# Altium project MainBoard.PrjPCB (part 2 of 2)

## Sheet Mainboard_MCU_Breakout.SchDoc
size C
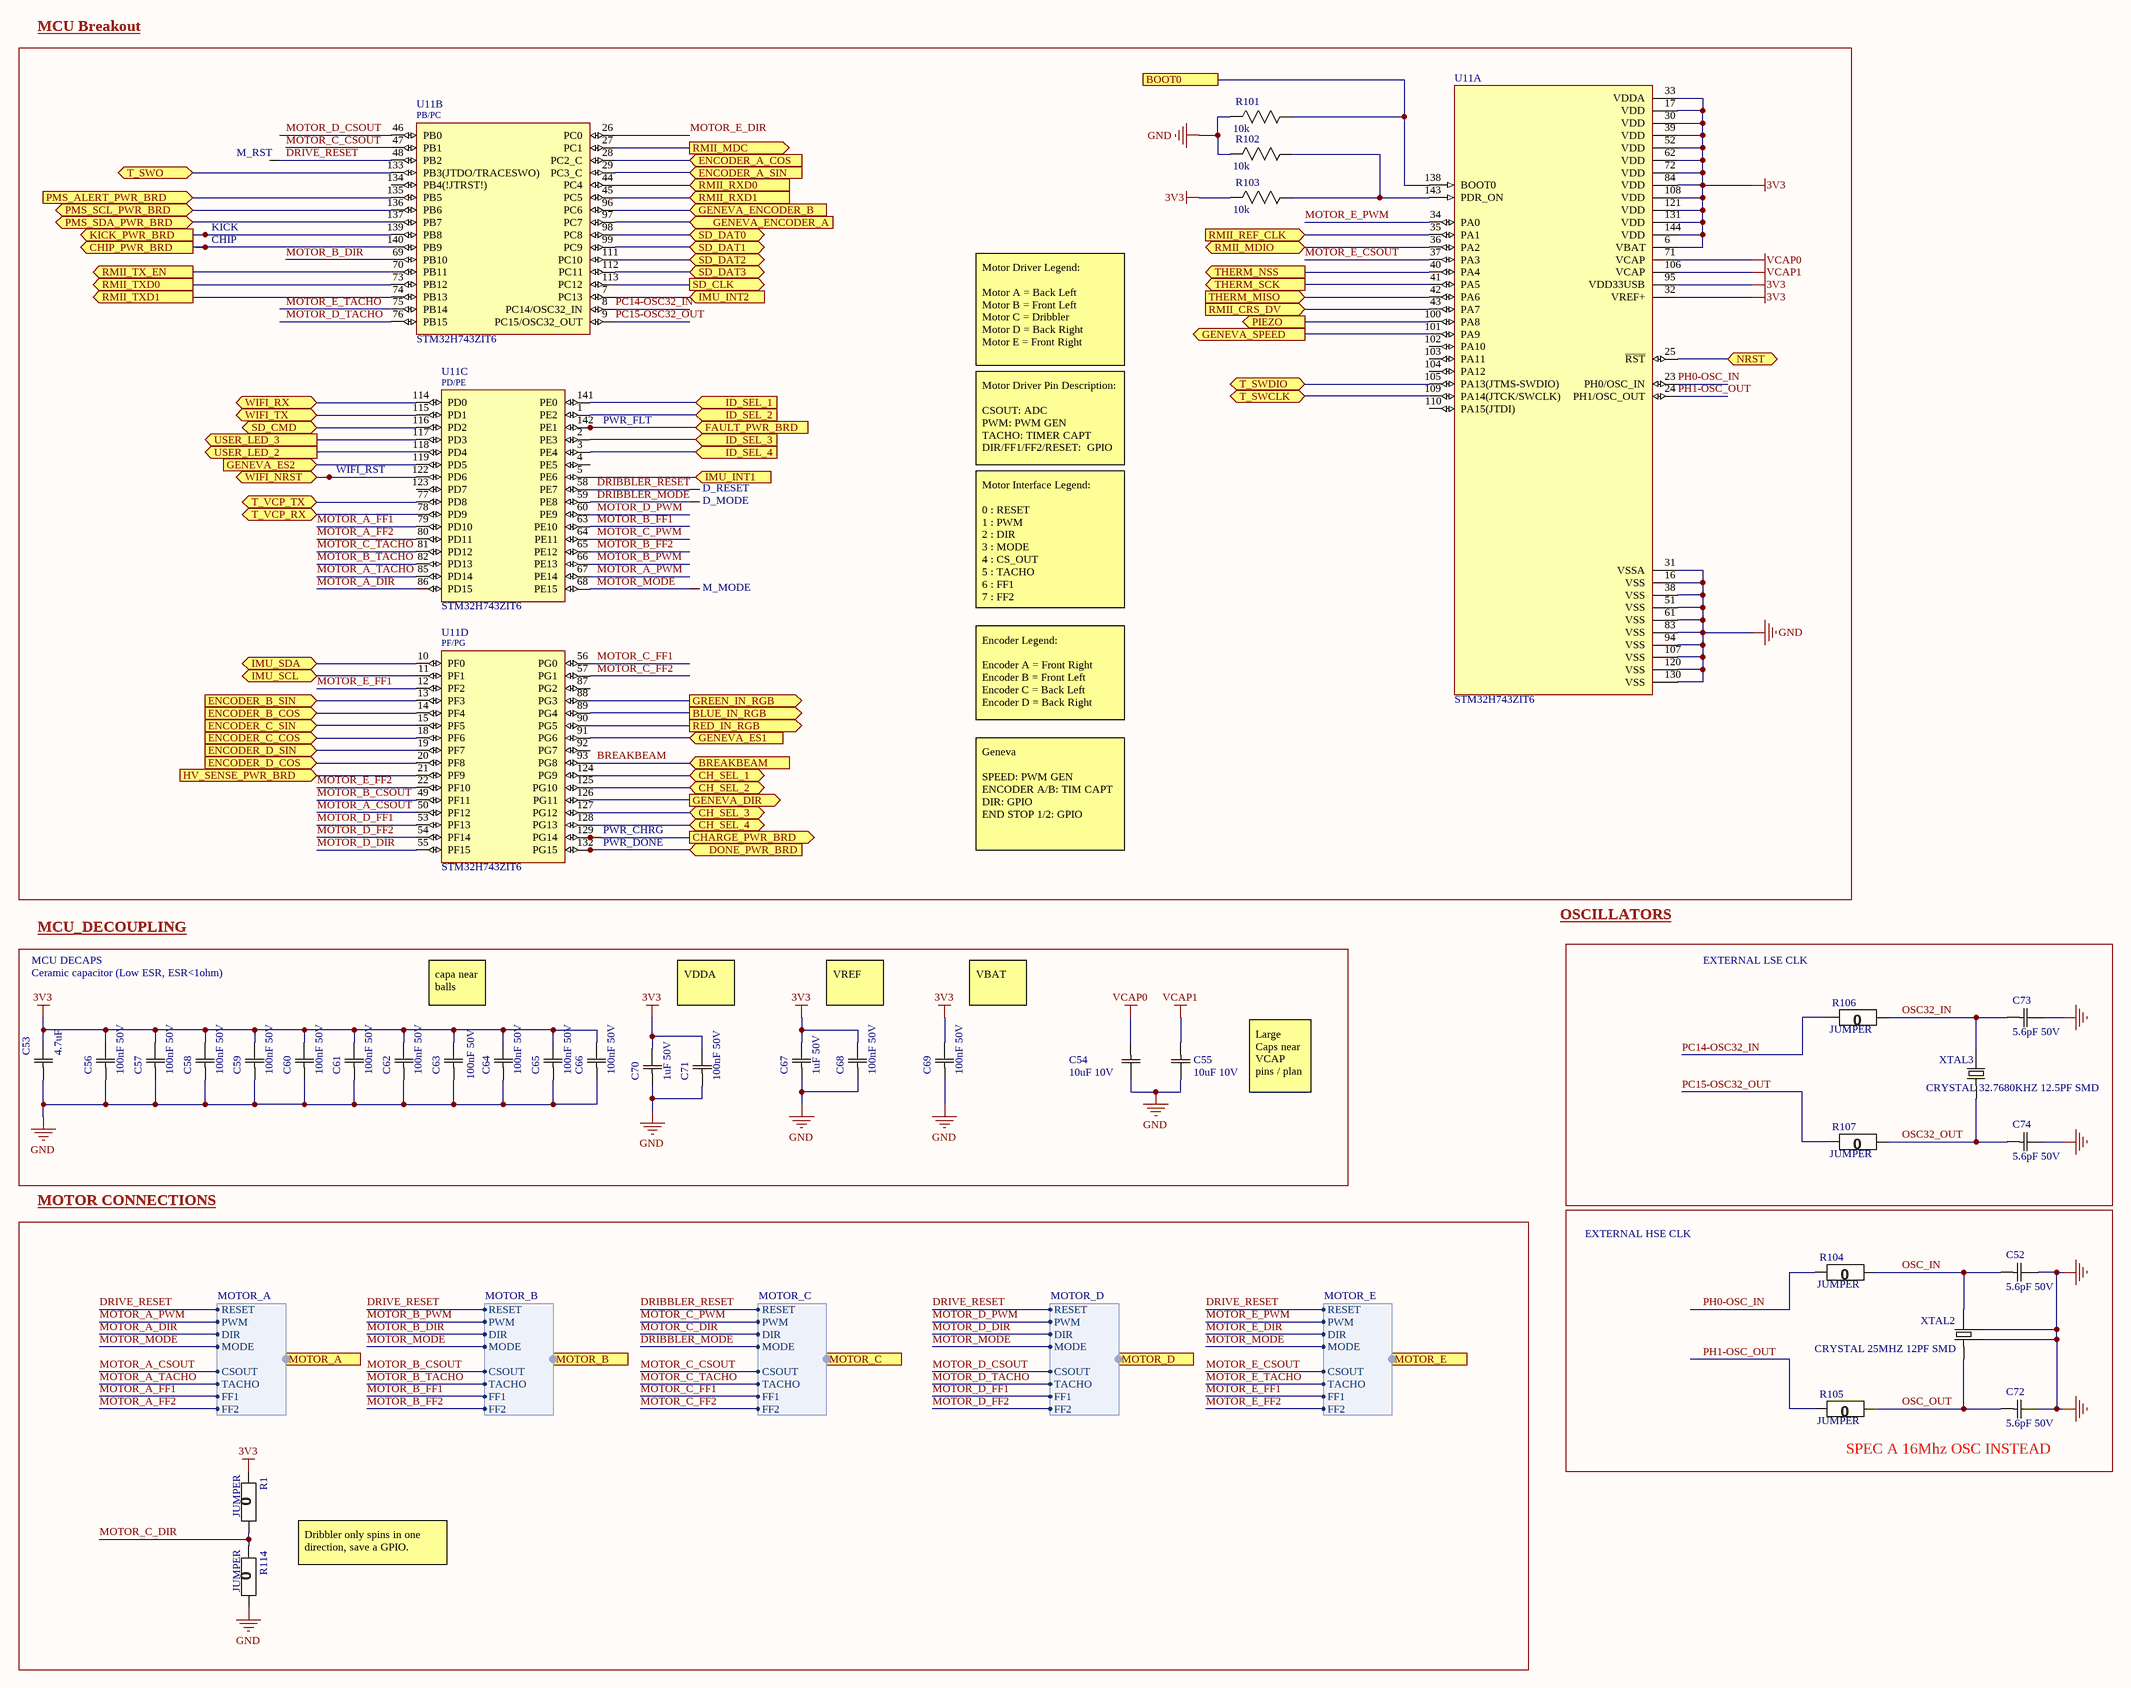
[diagram p8: Mainboard_MCU_Breakout.SchDoc]

### Parts
C52  5.6pF 50V  [0603]
C53  4.7uF  [0603]
C54  10uF 10V  [0603]
C55  10uF 10V  [0603]
C56  100nF 50V  [0603]
C57  100nF 50V  [0603]
C58  100nF 50V  [0603]
C59  100nF 50V  [0603]
C60  100nF 50V  [0603]
C61  100nF 50V  [0603]
C62  100nF 50V  [0603]
C63  100nF 50V  [0603]
C64  100nF 50V  [0603]
C65  100nF 50V  [0603]
C66  100nF 50V  [0603]
C67  1uF 50V  [0603]
C68  100nF 50V  [0603]
C69  100nF 50V  [0603]
C70  1uF 50V  [0603]
C71  100nF 50V  [0603]
C72  5.6pF 50V  [0603]
C73  5.6pF 50V  [0603]
C74  5.6pF 50V  [0603]
CHIP  Test Point (Via)  [TP]  (value not drawn)
D_MODE  Test Point (Via)  [TP]  (value not drawn)
D_RESET  Test Point (Via)  [TP]  (value not drawn)
KICK  Test Point (Via)  [TP]  (value not drawn)
M_MODE  Test Point (Via)  [TP]  (value not drawn)
M_RST  Test Point (Via)  [TP]  (value not drawn)
PWR_CHRG  Test Point (Via)  [TP]  (value not drawn)
PWR_DONE  Test Point (Via)  [TP]  (value not drawn)
PWR_FLT  Test Point (Via)  [TP]  (value not drawn)
R1  JUMPER  [0603]
R101  10k  [0603]
R102  10k  [0603]
R103  10k  [0603]
R104  JUMPER  [0603]
R105  JUMPER  [0603]
R106  JUMPER  [0603]
R107  JUMPER  [0603]
R114  JUMPER  [0603]
U11  STM32H743ZIT6  [QFP50P2200X2200X160-144N]  (parts A,B,C,D of 4)
WIFI_RST  Test Point (Via)  [TP]  (value not drawn)
XTAL2  CRYSTAL 25MHZ 12PF SMD  [3225-4SMD]
XTAL3  CRYSTAL 32.7680KHZ 12.5PF SMD  [3215 SMD2]

### Blocks framed on the sheet
MCU Breakout: CHIP D_MODE D_RESET KICK M_MODE M_RST PWR_CHRG PWR_DONE PWR_FLT R101-R103 U11 WIFI_RST
MCU_DECOUPLING: C53-C71
EXTERNAL LSE CLK: C73 C74 R106 R107 XTAL3
MOTOR CONNECTIONS: R1 R114
SPEC A 16Mhz OSC INSTEAD: C52 C72 R104 R105 XTAL2

### Ports
BLUE_IN_RGB (out), BOOT0, BREAKBEAM (in), CH_SEL_1 (bidir), CH_SEL_2 (bidir), CH_SEL_3 (bidir), CH_SEL_4 (bidir), CHARGE_PWR_BRD (out), CHIP_PWR_BRD (out), DONE_PWR_BRD (in), ENCODER_A_COS (in), ENCODER_A_SIN (in), ENCODER_B_COS (in), ENCODER_B_SIN (in), ENCODER_C_COS (in), ENCODER_C_SIN (in), ENCODER_D_COS (in), ENCODER_D_SIN (in), FAULT_PWR_BRD (in), GENEVA_DIR (out), GENEVA_ENCODER_A (in), GENEVA_ENCODER_B (in), GENEVA_ES1 (in), GENEVA_ES2 (in), GENEVA_SPEED (out), GREEN_IN_RGB (out), HV_SENSE_PWR_BRD (in), ID_SEL_1 (in), ID_SEL_2 (in), ID_SEL_3 (in), ID_SEL_4 (in), IMU_INT1 (in), IMU_INT2 (in), IMU_SCL (bidir), IMU_SDA (bidir), KICK_PWR_BRD (out), MOTOR_A (harness MOTOR_A), MOTOR_B (harness MOTOR_B), MOTOR_C (harness MOTOR_C), MOTOR_D (harness MOTOR_D), MOTOR_E (harness MOTOR_E), NRST (bidir), PIEZO (out), PMS_ALERT_PWR_BRD (in), PMS_SCL_PWR_BRD (bidir), PMS_SDA_PWR_BRD (bidir), RED_IN_RGB (out), RMII_CRS_DV (in), RMII_MDC (out), RMII_MDIO (bidir), RMII_REF_CLK (in), RMII_RXD0 (in), RMII_RXD1 (in), RMII_TX_EN (out), RMII_TXD0 (out), RMII_TXD1 (out), SD_CLK (out), SD_CMD (bidir), SD_DAT0 (bidir), SD_DAT1 (bidir), SD_DAT2 (bidir), SD_DAT3 (bidir), T_SWCLK (bidir), T_SWDIO (bidir), T_SWO (bidir), T_VCP_RX (bidir), T_VCP_TX (bidir), THERM_MISO (in), THERM_NSS (out), THERM_SCK (out), USER_LED_2 (out), USER_LED_3 (out), WIFI_NRST (bidir), WIFI_RX (bidir), WIFI_TX (bidir)

### Harnesses
MOTOR_E: DIR, MODE, TACHO, FF1, FF2, PWM, RESET, CSOUT
MOTOR_A: DIR, MODE, TACHO, FF1, FF2, PWM, RESET, CSOUT
MOTOR_B: DIR, MODE, TACHO, FF1, FF2, PWM, RESET, CSOUT
MOTOR_C: DIR, MODE, TACHO, FF1, FF2, PWM, RESET, CSOUT
MOTOR_D: DIR, MODE, TACHO, FF1, FF2, PWM, RESET, CSOUT

### Nets
3V3: C53.2(C2) C56.2(C2) C57.2(C2) C58.2(C2) C59.2(C2) C60.2(C2) C61.2(C2) C62.2(C2) C63.2(C2) C64.2(C2) C65.2(C2) C66.2(C2) C67.2(C2) C68.2(C2) C69.2(C2) C70.2(C2) C71.2(C2) R1.2(R2) R103.2(R2) U11.6(VBAT) U11.17(VDD) U11.30(VDD) U11.32(VREF+) U11.33(VDDA) U11.39(VDD) U11.52(VDD) U11.62(VDD) U11.72(VDD) U11.84(VDD) U11.95(VDD33USB) U11.108(VDD) U11.121(VDD) U11.131(VDD) U11.144(VDD)
GND: C52.2(C2) C53.1(C1) C54.2(C2) C55.2(C2) C56.1(C1) C57.1(C1) C58.1(C1) C59.1(C1) C60.1(C1) C61.1(C1) C62.1(C1) C63.1(C1) C64.1(C1) C65.1(C1) C66.1(C1) C67.1(C1) C68.1(C1) C69.1(C1) C70.1(C1) C71.1(C1) C72.2(C2) C73.2(C2) C74.2(C2) R101.2(R2) R102.2(R2) R114.1(R1) U11.16(VSS) U11.31(VSSA) U11.38(VSS) U11.51(VSS) U11.61(VSS) U11.83(VSS) U11.94(VSS) U11.107(VSS) U11.120(VSS) U11.130(VSS) XTAL2.2 XTAL2.4
VCAP0: C54.1(C1) U11.71(VCAP)
VCAP1: C55.1(C1) U11.106(VCAP)
BREAKBEAM: U11.93(PG8) ; port BREAKBEAM
CHARGE_PWR_BRD: PWR_CHRG.1 U11.129(PG14) ; port CHARGE_PWR_BRD
CHIP_PWR_BRD: CHIP.1 U11.140(PB9) ; port CHIP_PWR_BRD
DONE_PWR_BRD: PWR_DONE.1 U11.132(PG15) ; port DONE_PWR_BRD
DRIBBLER_MODE: D_MODE.1 U11.59(PE8) ; port MOTOR_C.MODE
DRIBBLER_RESET: D_RESET.1 U11.58(PE7) ; port MOTOR_C.RESET
DRIVE_RESET: M_RST.1 U11.48(PB2) ; port MOTOR_E.RESET, port MOTOR_A.RESET, port MOTOR_B.RESET, port MOTOR_D.RESET
EA_COS: U11.28(PC2_C) ; port ENCODER_A_COS
EA_SIN: U11.29(PC3_C) ; port ENCODER_A_SIN
EB_COS: U11.14(PF4) ; port ENCODER_B_COS
EB_SIN: U11.13(PF3) ; port ENCODER_B_SIN
EC_COS: U11.18(PF6) ; port ENCODER_C_COS
EC_SIN: U11.15(PF5) ; port ENCODER_C_SIN
ED_COS: U11.20(PF8) ; port ENCODER_D_COS
ED_SIN: U11.19(PF7) ; port ENCODER_D_SIN
FAULT_PWR_BRD: PWR_FLT.1 U11.142(PE1) ; port FAULT_PWR_BRD
GEN_DIR: U11.126(PG11) ; port GENEVA_DIR
GEN_ES1: U11.91(PG6) ; port GENEVA_ES1
GEN_ES2: U11.119(PD5) ; port GENEVA_ES2
GEN_SPD: U11.101(PA9) ; port GENEVA_SPEED
GENENC_A: U11.97(PC7) ; port GENEVA_ENCODER_A
GENENC_B: U11.96(PC6) ; port GENEVA_ENCODER_B
KICK_PWR_BRD: KICK.1 U11.139(PB8) ; port KICK_PWR_BRD
MOTOR_A_CSOUT: U11.50(PF12) ; port MOTOR_A.CSOUT  [project net CSOUT]
MOTOR_A_DIR: U11.86(PD15) ; port MOTOR_A.DIR  [project net DIR]
MOTOR_A_FF1: U11.79(PD10) ; port MOTOR_A.FF1  [project net FF1]
MOTOR_A_FF2: U11.80(PD11) ; port MOTOR_A.FF2  [project net FF2]
MOTOR_A_PWM: U11.67(PE14) ; port MOTOR_A.PWM
MOTOR_A_TACHO: U11.85(PD14) ; port MOTOR_A.TACHO
MOTOR_B_CSOUT: U11.49(PF11) ; port MOTOR_B.CSOUT  [project net CSOUT]
MOTOR_B_DIR: U11.69(PB10) ; port MOTOR_B.DIR  [project net DIR]
MOTOR_B_FF1: U11.63(PE10) ; port MOTOR_B.FF1  [project net FF1]
MOTOR_B_FF2: U11.65(PE12) ; port MOTOR_B.FF2  [project net FF2]
MOTOR_B_PWM: U11.66(PE13) ; port MOTOR_B.PWM
MOTOR_B_TACHO: U11.82(PD13) ; port MOTOR_B.TACHO
MOTOR_C_CSOUT: U11.47(PB1) ; port MOTOR_C.CSOUT  [project net CSOUT]
MOTOR_C_DIR: R1.1(R1) R114.2(R2) ; port MOTOR_C.DIR  [project net DIR]
MOTOR_C_FF1: U11.56(PG0) ; port MOTOR_C.FF1  [project net FF1]
MOTOR_C_FF2: U11.57(PG1) ; port MOTOR_C.FF2  [project net FF2]
MOTOR_C_PWM: U11.64(PE11) ; port MOTOR_C.PWM
MOTOR_C_TACHO: U11.81(PD12) ; port MOTOR_C.TACHO
MOTOR_D_CSOUT: U11.46(PB0) ; port MOTOR_D.CSOUT  [project net CSOUT]
MOTOR_D_DIR: U11.55(PF15) ; port MOTOR_D.DIR  [project net DIR]
MOTOR_D_FF1: U11.53(PF13) ; port MOTOR_D.FF1  [project net FF1]
MOTOR_D_FF2: U11.54(PF14) ; port MOTOR_D.FF2  [project net FF2]
MOTOR_D_PWM: U11.60(PE9) ; port MOTOR_D.PWM
MOTOR_D_TACHO: U11.76(PB15) ; port MOTOR_D.TACHO
MOTOR_E_CSOUT: U11.37(PA3) ; port MOTOR_E.CSOUT  [project net CSOUT]
MOTOR_E_DIR: U11.26(PC0) ; port MOTOR_E.DIR  [project net DIR]
MOTOR_E_FF1: U11.12(PF2) ; port MOTOR_E.FF1  [project net FF1]
MOTOR_E_FF2: U11.22(PF10) ; port MOTOR_E.FF2  [project net FF2]
MOTOR_E_PWM: U11.34(PA0) ; port MOTOR_E.PWM
MOTOR_E_TACHO: U11.75(PB14) ; port MOTOR_E.TACHO
MOTOR_MODE: M_MODE.1 U11.68(PE15) ; port MOTOR_E.MODE, port MOTOR_A.MODE, port MOTOR_B.MODE, port MOTOR_D.MODE  [project net MODE]
NRST: U11.25(~{RST}) ; port NRST
OSC32_IN: C73.1(C1) R106.1(R1) XTAL3.2
OSC32_OUT: C74.1(C1) R107.1(R1) XTAL3.1
OSC_IN: C52.1(C1) R104.1(R1) XTAL2.3
OSC_OUT: C72.1(C1) R105.1(R1) XTAL2.1
PC14-OSC32_IN: R106.2(R2) U11.8(PC14/OSC32_IN)
PC15-OSC32_OUT: R107.2(R2) U11.9(PC15/OSC32_OUT)
PH0-OSC_IN: R104.2(R2) U11.23(PH0/OSC_IN)
PH1-OSC_OUT: R105.2(R2) U11.24(PH1/OSC_OUT)
PMS_ALERT_PWR_BRD: U11.135(PB5) ; port PMS_ALERT_PWR_BRD
PMS_SCL_PWR_BRD: U11.136(PB6) ; port PMS_SCL_PWR_BRD
PMS_SDA_PWR_BRD: U11.137(PB7) ; port PMS_SDA_PWR_BRD
RMII_CRS_DV: U11.43(PA7) ; port RMII_CRS_DV
RMII_MDC: U11.27(PC1) ; port RMII_MDC
RMII_MDIO: U11.36(PA2) ; port RMII_MDIO
RMII_REF_CLK: U11.35(PA1) ; port RMII_REF_CLK
RMII_RXD0: U11.44(PC4) ; port RMII_RXD0
RMII_RXD1: U11.45(PC5) ; port RMII_RXD1
RMII_TX_EN: U11.70(PB11) ; port RMII_TX_EN
RMII_TXD0: U11.73(PB12) ; port RMII_TXD0
RMII_TXD1: U11.74(PB13) ; port RMII_TXD1
NetD3_1: U11.100(PA8) ; port PIEZO
NetHV_FB1_1: U11.21(PF9) ; port HV_SENSE_PWR_BRD
NetJ9_2: U11.114(PD0) ; port WIFI_RX
NetJ9_3: U11.115(PD1) ; port WIFI_TX
NetJ9_4: U11.122(PD6) WIFI_RST.1 ; port WIFI_NRST
NetJ12_1: U11.111(PC10) ; port SD_DAT2
NetJ12_2: U11.112(PC11) ; port SD_DAT3
NetJ12_3: U11.116(PD2) ; port SD_CMD
NetJ12_5: U11.113(PC12) ; port SD_CLK
NetJ12_7: U11.98(PC8) ; port SD_DAT0
NetJ12_8: U11.99(PC9) ; port SD_DAT1
NetPboot1_1: R101.1(R1) U11.138(BOOT0) ; port BOOT0
NetR91_2: U11.118(PD4) ; port USER_LED_2
NetR94_1: U11.90(PG5) ; port RED_IN_RGB
NetR95_1: U11.89(PG4) ; port BLUE_IN_RGB
NetR97_1: U11.88(PG3) ; port GREEN_IN_RGB
NetR99_2: U11.117(PD3) ; port USER_LED_3
NetR102_1: R102.1(R1) R103.1(R1) U11.143(PDR_ON)
NetR109_1: U11.41(PA5) ; port THERM_SCK
NetR110_1: U11.42(PA6) ; port THERM_MISO
NetR111_1: U11.40(PA4) ; port THERM_NSS
NetR115_2: U11.124(PG9) ; port CH_SEL_1
NetR116_2: U11.125(PG10) ; port CH_SEL_2
NetR117_2: U11.127(PG12) ; port CH_SEL_3
NetR118_2: U11.128(PG13) ; port CH_SEL_4
NetR119_2: U11.141(PE0) ; port ID_SEL_1
NetR120_2: U11.1(PE2) ; port ID_SEL_2
NetR121_2: U11.2(PE3) ; port ID_SEL_3
NetR122_2: U11.3(PE4) ; port ID_SEL_4
NetU9_4: U11.5(PE6) ; port IMU_INT1
NetU9_9: U11.7(PC13) ; port IMU_INT2
NetU9_13: U11.11(PF1) ; port IMU_SCL
NetU9_14: U11.10(PF0) ; port IMU_SDA
NetU10_4: U11.105(PA13(JTMS-SWDIO)) ; port T_SWDIO
NetU10_6: U11.133(PB3(JTDO/TRACESWO)) ; port T_SWO
NetU10_12: U11.77(PD8) ; port T_VCP_TX
NetU10_13: U11.109(PA14(JTCK/SWCLK)) ; port T_SWCLK
NetU10_15: U11.78(PD9) ; port T_VCP_RX

Not connected (* = marked no-connect by the designer): U11 4(PE5) 87(PG2) 92(PG7) 102(PA10) 103(PA11) 104(PA12) 110(PA15(JTDI)) 123(PD7) 134(PB4(!JTRST!))

### Notes on the sheet
- Motor Driver Legend:
  Motor A = Back Left
  Motor B = Front Left
  Motor C = Dribbler
  Motor D = Back Right
  Motor E = Front Right
- Motor Driver Pin Description:
  CSOUT: ADC
  PWM: PWM GEN
  TACHO: TIMER CAPT
  DIR/FF1/FF2/RESET:  GPIO
- Motor Interface Legend:
  0 : RESET
  1 : PWM
  2 : DIR
  3 : MODE
  4 : CS_OUT
  5 : TACHO
  6 : FF1
  7 : FF2
- Encoder Legend:
  Encoder A = Front Right
  Encoder B = Front Left
  Encoder C = Back Left
  Encoder D = Back Right
- Geneva
  SPEED: PWM GEN
  ENCODER A/B: TIM CAPT
  DIR: GPIO
  END STOP 1/2: GPIO
- MCU DECAPS
- Ceramic capacitor (Low ESR, ESR<1ohm)
- OSCILLATORS
- capa near balls
- VDDA
- VREF
- VBAT
- Large Caps near VCAP pins / plan
- EXTERNAL HSE CLK
- Dribbler only spins in one direction, save a GPIO.
- (in symbol STM32H743ZIT6, part B) PB/PC
- (in symbol STM32H743ZIT6, part C) PD/PE
- (in symbol STM32H743ZIT6, part D) PF/PG

### Library data of the parts
C52 C72-C74 = CAP 5.6pF 50V: CAP CER 5.6PF 50V C0G/NP0 0805; Tolerance: 5%; Package: 0805; Value: 5.6pF; Rating: 50V; Temperature Coefficient: C0G/NP0; Operating Temperature: -55°C ~ 125°C
C53 = CAP 4.7uF 35V: CAP CER 4.7UF 35V X7R 0603/0805; Tolerance: 10%; Package: 0603/0805; Value: 4.7uF; Rating: 35V; Temperature Coefficient: X7R; Operating Temperature: -55°C ~ 125°C
C54 C55 = CAP 10uF 10V: CAP CER 10UF 10V X5R 0805; Tolerance: 10%; Package: 0805; Value: 10uF; Rating: 10V
C56-C66 C68 C69 C71 = CAP 100nF 50V: CAP CER 0.1UF 50V X7R 0805; Tolerance: 10%; Package: 0805; Value: 100nF; Rating: 50V
C67 C70 = CAP 1uF 50V: CAP CER 1UF 50V X7R 0805; Tolerance: 10%; Package: 0805; Value: 1uF; Rating: 50V; Temperature Coefficient: X7R; Operating Temperature: -55°C ~ 125°C
R1 R104-R107 R114 = RES 0 JUMPER: as R77 on sheet Mainboard_RMII_Interface; Package: 0805
R101-R103 = RES 10k 1/8W - 1%: as R62 on sheet Mainboard_RMII_Interface; Package: 0805; Value: 10k; Tolerance: 1%
U11 = STM32H743ZIT6: ARM® Cortex®-M7 STM32H7 Microcontroller IC 32-Bit 480MHz 2MB (2M x 8) FLASH 144-LQFP (20x20); MF: STMicroelectronics; Package: LQFP-144 STMicroelectronics; MP: STM32H743ZIT6; ComponentLink1Description: SnapEDA; ComponentLink1URL: https://www.snapeda.com/parts/STM32H743ZIT6/STMicroelectronics/view-part/1041111/?ref=snap; ComponentLink2Description: DigiKey; ComponentLink2URL: https://www.digikey.ca/en/products/detail/stmicroelectronics/STM32H743ZIT6/7809238; ComponentLink3Description: Datasheet; ComponentLink3URL: https://www.st.com/resource/en/datasheet/stm32h743bi.pdf; Digikey: 497-17721-ND
XTAL2 = XTAL 25MHZ 12PF SMD4: 25MHz ±10ppm Crystal 12pF 40 Ohms 2-SMD, No Lead; MP: X322525MOB4SI; MF: Yangxing Tech; ESR: 70 Ohms; Package: 2-SMD, No Lead; Frequency: 25MHz; Load Capacitance: 12pF; Supplier 1: Digi-Key
XTAL3 = XTAL 32.7680KHZ 12.5PF SMD 3215: 32.768kHz ±20ppm Crystal 12.5pF 70 kOhms 3215SMD, No Lead; MP: Q13FC1350000400; MF: Seiko Epson; Package: 2-SMD, No Lead; Frequency: 32.768kHz; Load Capacitance: 12.5pF; ESR: 70 kOhms; ComponentLink1Description: Digikey; ComponentLink1URL: https://www.digikey.ca/en/products/detail/ndk-america-inc/NX3215SA-32-768K-STD-MUA-8/2261469; ComponentLink2Description: Datasheet; ComponentLink2URL: https://media.digikey.com/datasheets/production/702868/1/NX3215SA-32-768K-STD-MUA-8.html; Supplier 1: RSComponents; Supplier Part Number 1: 1712309

## Sheet Mainboard_MCU_Func.SchDoc
size A4
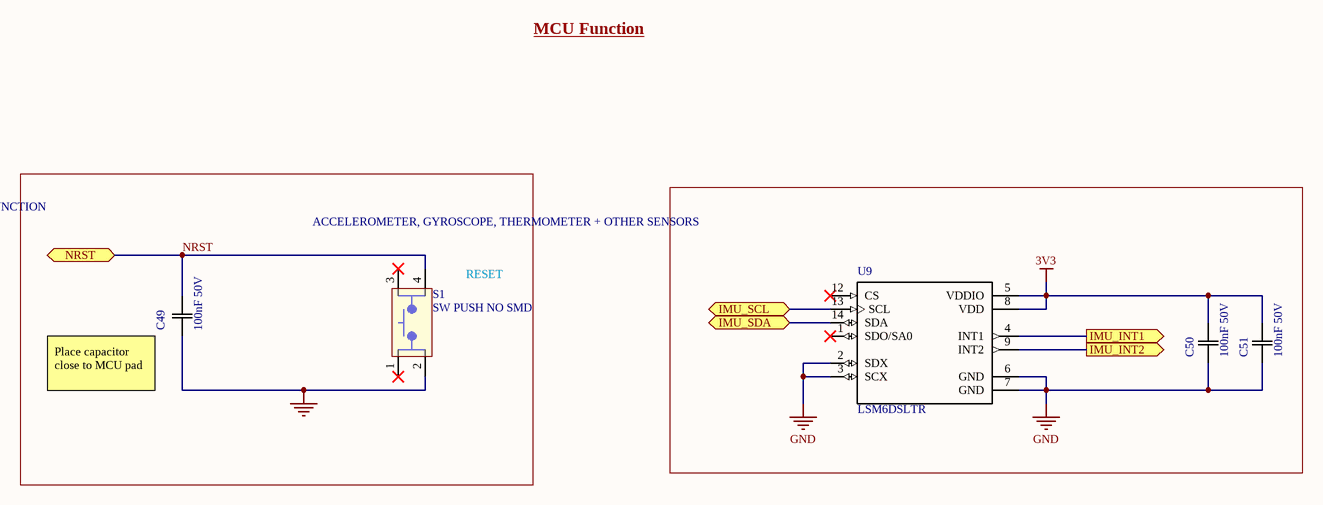
[diagram p9: Mainboard_MCU_Func.SchDoc]

### Parts
C49  100nF 50V  [0603]
C50  100nF 50V  [0603]
C51  100nF 50V  [0603]
S1  SW PUSH NO SMD  [TL3305]
U9  LSM6DSLTR  [LGA-14]

### Blocks framed on the sheet
ACCELEROMETER, GYROSCOPE, THERMOMETER + OTHER SENSORS: C50 C51 U9

### Ports
IMU_INT1 (out), IMU_INT2 (out), IMU_SCL (bidir), IMU_SDA (bidir), NRST (bidir)

### Nets
3V3: C50.2(C2) C51.2(C2) U9.5(VDDIO) U9.8(VDD)
GND: C49.1(C1) C50.1(C1) C51.1(C1) S1.2 U9.2(SDX) U9.3(SCX) U9.6(GND) U9.7(GND)
NRST: C49.2(C2) S1.4 ; port NRST
NetU9_4: U9.4(INT1) ; port IMU_INT1
NetU9_9: U9.9(INT2) ; port IMU_INT2
NetU9_13: U9.13(SCL) ; port IMU_SCL
NetU9_14: U9.14(SDA) ; port IMU_SDA

Not connected (* = marked no-connect by the designer): S1 1* 3*; U9 1(SDO/SA0)* 12(CS)*

### Notes on the sheet
- MCU Function
- RESET FUNCTION
- (near S1) RESET
- (near C49) Place capacitor close to MCU pad

### Library data of the parts
C49-C51 = CAP 100nF 50V: as C56 on sheet Mainboard_MCU_Breakout; Package: 0805; Value: 100nF; Rating: 50V
S1 = SW PUSH NO SMD: Tactile Switch SPST-NO Top Actuated Surface Mount 12V 50mA; MF: E-Switch; MP: TL3305BF260QG; Switch Function: Off-Mom; Actuator Height: 5mm; Digikey: EG5354DKR-ND; ComponentLink1Description: Digikey; ComponentLink1URL: https://www.digikey.ca/en/products/detail/e-switch/TL3305BF260QG/5816185; ComponentLink2Description: Datasheet; ComponentLink2URL: https://sten-eswitch-13110800-production.s3.amazonaws.com/system/asset/product_line/data_sheet/213/TL3305.pdf; Circuit: SPST-NO; Mounting Type: SMD
U9 = IMU LSM6DSLTR: IMU ACCEL/GYRO I2C/SPI 14LGA; MF: STMicroelectronics; SnapEDA_Link: https://www.snapeda.com/parts/LSM6DSLTR/STMicroelectronics/view-part/550517/?ref=snap; MP: LSM6DSLTR; Package: LGA-14 STMicroelectronics; Digikey: https://www.digikey.ca/product-detail/en/stmicroelectronics/LSM6DSLTR/497-16705-1-ND/6192805; Supplier 1: Digi-Key; Supplier Part Number 1: 497-16705-1-ND

## Sheet Mainboard_ThermistorAmp.SchDoc
size A
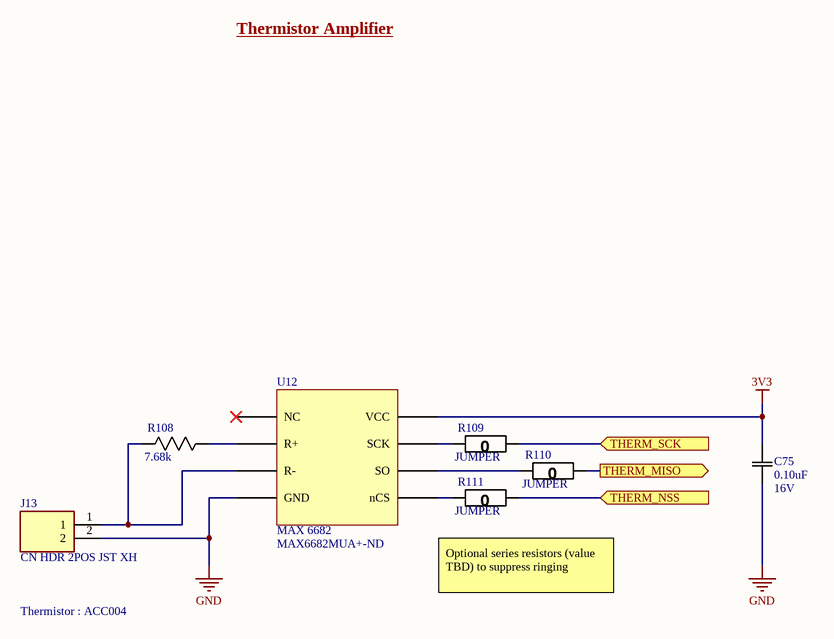
[diagram p10: Mainboard_ThermistorAmp.SchDoc]

### Parts
C75  Rating: 16V  [0603]  (hidden comment: 0.10uF)
J13  CN HDR 2POS JST XH  [JST_B2B-XH-A(LF)(SN)]
R108  7.68k  [0805]
R109  JUMPER  [0603]
R110  JUMPER  [0603]
R111  JUMPER  [0603]
U12  MAX 6682  Supplier Part Number 1: MAX6682MUA+-ND  [8-MSOP]

### Ports
THERM_MISO (out), THERM_NSS (in), THERM_SCK (in)

### Nets
3V3: C75.1(C1) U12.8(VCC)
GND: C75.2(C2) J13.2 U12.4(GND)
NetJ13_1: J13.1 R108.2(R2) U12.3(R-)
NetR108_1: R108.1(R1) U12.2(R+)
NetR109_1: R109.1(R1) ; port THERM_SCK
NetR109_2: R109.2(R2) U12.7(SCK)
NetR110_1: R110.1(R1) ; port THERM_MISO
NetR110_2: R110.2(R2) U12.6(SO)
NetR111_1: R111.1(R1) ; port THERM_NSS
NetR111_2: R111.2(R2) U12.5(nCS)

Not connected (* = marked no-connect by the designer): U12 1(NC)*

### Notes on the sheet
- Thermistor Amplifier
- Optional series resistors (value TBD) to suppress ringing
- Thermistor : ACC004

### Library data of the parts
C75 = CAP 0.10uF 16V: CAP CER 0.10UF 16V X5R 0603/0805; Tolerance: 10%; Package: 0603/0805; Temperature Coefficient: X5R; Operating Temperature: -55°C ~ 85°C; Value: 0.10uF
J13 = CN HDR 2POS JST XH: as HV_FB1 on sheet Mainboard_Power_Interface; Price: None; Package: None; Value: *; Availability: Unavailable; SnapEDA_Link: https://www.snapeda.com/parts/B2B-XH-A%28LF%29%28SN%29/JST%20Sales%20America%20Inc./view-part/492310/?ref=snap
R108 = RES 7.68k 0.15W: RES SMD 7.68K OHM 0.1% 0.15W 0805; Power (Watts): 0.125W; Tolerance: 5%; Package: 0805; Value: 7.68k
R109-R111 = RES 0 JUMPER: as R77 on sheet Mainboard_RMII_Interface; Package: 0805
U12 = MAX 6682: MAX 6685 Thermistor - SPI converter, 8bit; Supplier 1: Digi-Key

## Sheet Mainboard_User_Interface.SchDoc
size A4
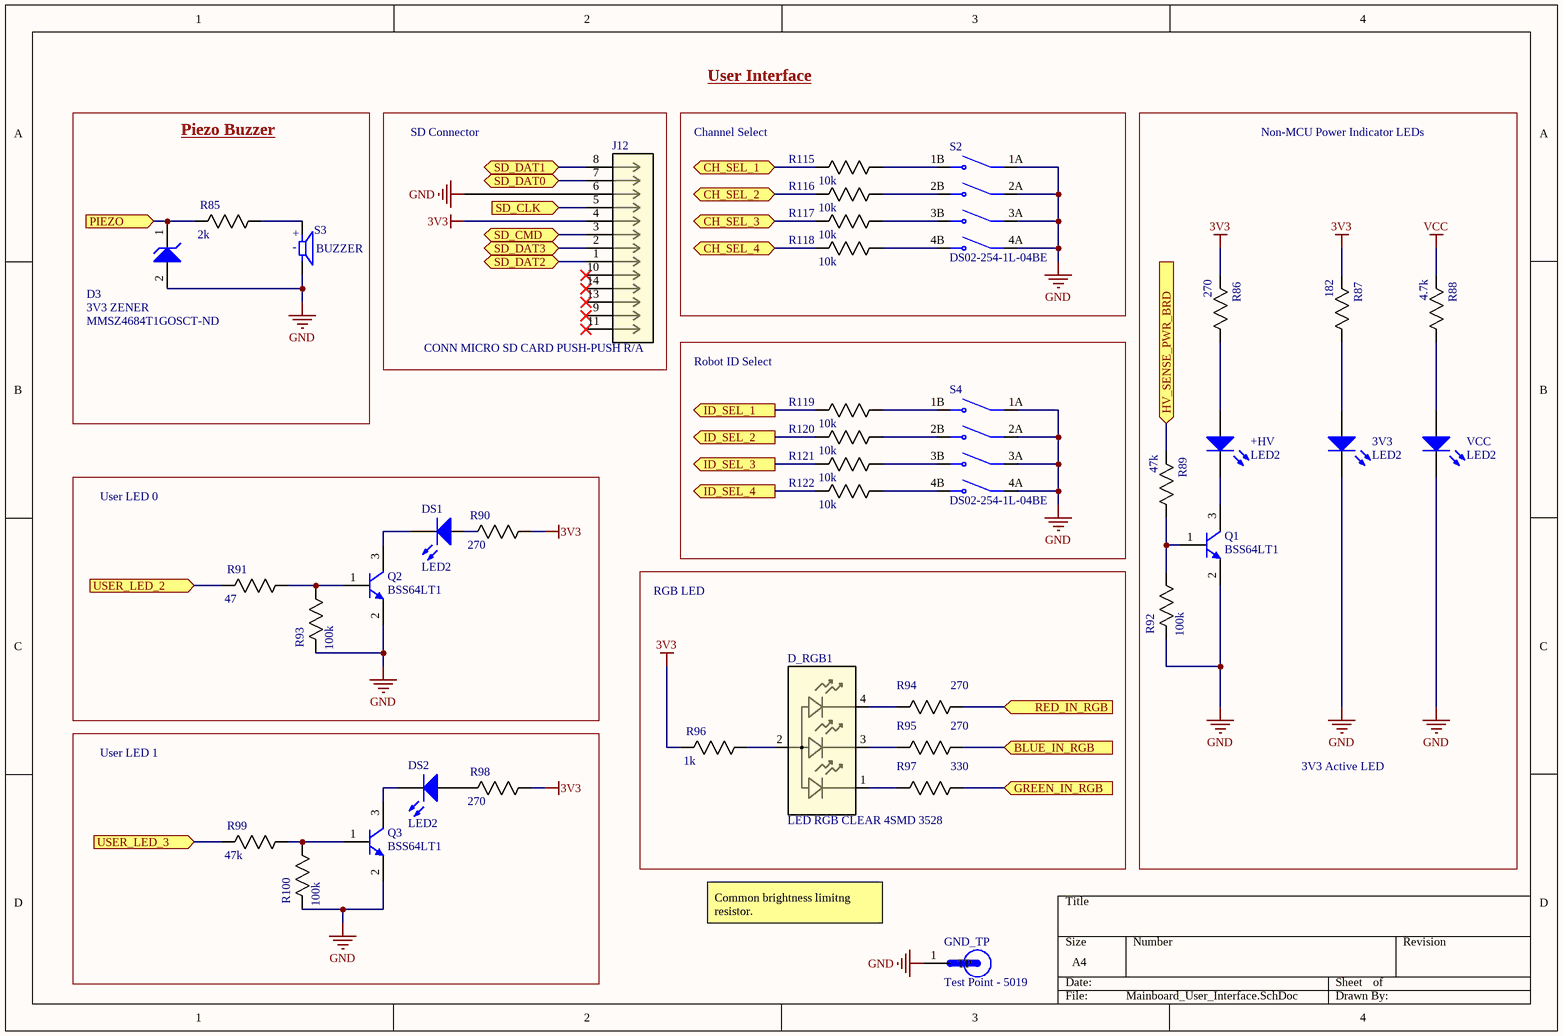
[diagram p11: Mainboard_User_Interface.SchDoc]

### Parts
3V3  LED2  [3.2X1.6X1.1]
+HV  LED2  [3.2X1.6X1.1]
D3  3V3 ZENER  Supplier Part Number 1: MMSZ4684T1GOSCT-ND  [ONSC-SOD-123-2-425-04_V]
D_RGB1  LED RGB CLEAR 4SMD 3528  [LED 4pin 3.5 x 2.8]
DS1  LED2  [3.2X1.6X1.1]
DS2  LED2  [3.2X1.6X1.1]
GND_TP  Test Point - 5019  [TP380X203]
J12  CONN MICRO SD CARD PUSH-PUSH R/A  [SD Connector 5027740891]
Q1  BSS64LT1  [ONSC-SOT-23-3-318-08_V]
Q2  BSS64LT1  [ONSC-SOT-23-3-318-08_V]
Q3  BSS64LT1  [ONSC-SOT-23-3-318-08_V]
R85  2k  [0603]
R86  270  [0603]
R87  182  [0603]
R88  4.7k  [0603]
R89  47k  [0603]
R90  270  [0603]
R91  47  [0603]
R92  100k  [0603]
R93  100k  [0603]
R94  270  [0603]
R95  270  [0603]
R96  1k  [0603]
R97  330  [0603]
R98  270  [0603]
R99  47k  [0603]
R100  100k  [0603]
R115  10k  [0603]
R116  10k  [0603]
R117  10k  [0603]
R118  10k  [0603]
R119  10k  [0603]
R120  10k  [0603]
R121  10k  [0603]
R122  10k  [0603]
S2  DS02-254-1L-04BE  [SW_DS02-254-1L-04BE]
S3  BUZZER  [BUZZER PKM13EPYH4000-A0]
S4  DS02-254-1L-04BE  [SW_DS02-254-1L-04BE]
VCC  LED2  [3.2X1.6X1.1]

### Blocks framed on the sheet
Piezo Buzzer: D3 R85 S3
SD Connector: J12
Channel Select: R115-R118 S2
Robot ID Select: R119-R122 S4
User LED 0: DS1 Q2 R90 R91 R93
RGB LED: D_RGB1 R94-R97
User LED 1: DS2 Q3 R98-R100

### Ports
BLUE_IN_RGB (in), CH_SEL_1 (bidir), CH_SEL_2 (bidir), CH_SEL_3 (bidir), CH_SEL_4 (bidir), GREEN_IN_RGB (in), HV_SENSE_PWR_BRD (in), ID_SEL_1 (out), ID_SEL_2 (out), ID_SEL_3 (out), ID_SEL_4 (out), PIEZO (in), RED_IN_RGB (in), SD_CLK (in), SD_CMD (bidir), SD_DAT0 (bidir), SD_DAT1 (bidir), SD_DAT2 (bidir), SD_DAT3 (bidir), USER_LED_2 (in), USER_LED_3 (in)

### Nets
3V3: J12.4 R86.2(R2) R87.2(R2) R90.1(R1) R96.2(R2) R98.1(R1)
GND: 3V3.2(K) D3.2(A) GND_TP.1(TP) J12.6 Q1.2(E) Q2.2(E) Q3.2(E) R92.2(R2) R93.2(R2) R100.2(R2) S2.1A(COM1) S2.2A(COM2) S2.3A(COM3) S2.4A(COM4) S3.N S4.1A(COM1) S4.2A(COM2) S4.3A(COM3) S4.4A(COM4) VCC.2(K)
VCC: R88.2(R2)
Net3V3_1: 3V3.1(A) R87.1(R1)
Net+HV_1: +HV.1(A) R86.1(R1)
Net+HV_2: +HV.2(K) Q1.3(C)
NetD3_1: D3.1(K) R85.2(R2) ; port PIEZO
NetD_RGB1_1: D_RGB1.1 R97.2(R2)
NetD_RGB1_2: D_RGB1.2 R96.1(R1)
NetD_RGB1_3: D_RGB1.3 R95.2(R2)
NetD_RGB1_4: D_RGB1.4 R94.2(R2)
NetDS1_1: DS1.1(A) R90.2(R2)
NetDS1_2: DS1.2(K) Q2.3(C)
NetDS2_1: DS2.1(A) R98.2(R2)
NetDS2_2: DS2.2(K) Q3.3(C)
NetHV_FB1_1: R89.2(R2) ; port HV_SENSE_PWR_BRD
NetJ12_1: J12.1 ; port SD_DAT2
NetJ12_2: J12.2 ; port SD_DAT3
NetJ12_3: J12.3 ; port SD_CMD
NetJ12_5: J12.5 ; port SD_CLK
NetJ12_7: J12.7 ; port SD_DAT0
NetJ12_8: J12.8 ; port SD_DAT1
NetQ1_1: Q1.1(B) R89.1(R1) R92.1(R1)
NetQ2_1: Q2.1(B) R91.1(R1) R93.1(R1)
NetQ3_1: Q3.1(B) R99.1(R1) R100.1(R1)
NetR85_1: R85.1(R1) S3.P
NetR88_1: R88.1(R1) VCC.1(A)
NetR91_2: R91.2(R2) ; port USER_LED_2
NetR94_1: R94.1(R1) ; port RED_IN_RGB
NetR95_1: R95.1(R1) ; port BLUE_IN_RGB
NetR97_1: R97.1(R1) ; port GREEN_IN_RGB
NetR99_2: R99.2(R2) ; port USER_LED_3
NetR115_1: R115.1(R1) S2.1B(NO1)
NetR115_2: R115.2(R2) ; port CH_SEL_1
NetR116_1: R116.1(R1) S2.2B(NO2)
NetR116_2: R116.2(R2) ; port CH_SEL_2
NetR117_1: R117.1(R1) S2.3B(NO3)
NetR117_2: R117.2(R2) ; port CH_SEL_3
NetR118_1: R118.1(R1) S2.4B(NO4)
NetR118_2: R118.2(R2) ; port CH_SEL_4
NetR119_1: R119.1(R1) S4.1B(NO1)
NetR119_2: R119.2(R2) ; port ID_SEL_1
NetR120_1: R120.1(R1) S4.2B(NO2)
NetR120_2: R120.2(R2) ; port ID_SEL_2
NetR121_1: R121.1(R1) S4.3B(NO3)
NetR121_2: R121.2(R2) ; port ID_SEL_3
NetR122_1: R122.1(R1) S4.4B(NO4)
NetR122_2: R122.2(R2) ; port ID_SEL_4

Not connected (* = marked no-connect by the designer): J12 9* 10* 11* 13* 14*

### Notes on the sheet
- User Interface
- Non-MCU Power Indicator LEDs
- 3V3 Active LED
- Common brightness limitng resistor.
- (in symbol BUZZER PKM13EPYH4000-A0) +; -

### Library data of the parts
3V3 +HV DS1 VCC = LED GREEN SMD: Typical RED, GREEN, YELLOW, AMBER GaAs LED; Voltage - Forward (Vf) (Typ): 2V; Lens Transparency: Clear; Current - Test: 20mA; Package: 1206; Color: Green
D3 = DIODE ZENER 3.3 500mW: Zener 3V3 Voltage Regulator, 500 mW, 2-Pin SOD-123, Pb-Free, Tape and Reel; PartNumber: MMSZ4684T1G; Manufacturer: On Semiconductor; P Max (W): 0.5; VZ Typ (V): 3.3; ComponentLink2URL: http://www.onsemi.com/pub_link/Collateral/MMSZ4678T1-D.PDF; ComponentLink1URL: http://www.onsemi.com/; ComponentLink2Description: Datasheet; ComponentLink3URL: http://www.onsemi.com/pub_link/Collateral/425-04.PDF; DatasheetVersion: Rev. 9; ComponentLink1Description: Manufacturer URL; RoHS: Pb-Free; ComponentLink3Description: Package Specification; PackageReference: SOD-123-2-425-04; PackageVersion: Rev. G, 10/2009; Mounting Technology: Surface Mount; Packing: Tape and Reel; PackageDescription: 2-Pin SOD, Body 1.6 x 2.69 mm; Supplier 1: Digi-Key
D_RGB1 = LED RGB CLEAR 4SMD 3528: LED RGB No Lead / AAA3528
DS2 = LED RED SMD: Typical RED, GREEN, YELLOW, AMBER GaAs LED; Lens Color: Colorless; Voltage - Forward (Vf) (Typ): 1.7V; Current - Test: 20mA; Lens Transparency: Clear; Package: 1206; Color: Red
GND_TP = Test Point - 5019: PC Test Point, Miniature Phosphor Bronze, Silver Plating Surface Mount Mounting Type; MP: 5019; MF: Keystone Electronics; Value: *; Package: 2010 Keystone; Digi-Key_Part_Number: 36-5019CT-ND; Digi-Key_Purchase_URL: https://www.digikey.com/product-detail/en/keystone-electronics/5019/36-5019CT-ND/3907344?utm_source=snapeda&utm_medium=aggregator&utm_campaign=symbol
J12 = CONN MICRO SD CARD PUSH-PUSH R/A: 10 (8 + 2) Position Card Connector Secure Digital - microSD™ Surface Mount, Right Angle Gold; MF: Molex; MP: 5027740891; ComponentLink1Description: Digikey; ComponentLink1URL: https://www.digikey.ca/en/products/detail/molex/5027740891/1952536; Digikey: WM24066CT-ND; ComponentLink2Description: Datasheet; ComponentLink2URL: https://www.molex.com/pdm_docs/sd/5027740891_sd.pdf
Q1-Q3 = CMP-1048-00605-1: Driver Transistor, NPN Silicon, 3-Pin SOT-23, Tape and Reel; Manufacturer: On Semiconductor; IC Continuous (A): 0.1; fT Min (MHz): 60; ComponentLink1Description: Manufacturer URL; ComponentLink3Description: Package Specification; ComponentLink2URL: http://www.onsemi.com/pub_link/Collateral/BSS64LT1-D.PDF; ComponentLink1URL: http://www.onsemi.com/; ComponentLink2Description: Datasheet; ComponentLink3URL: http://www.onsemi.cn/pub_link/Collateral/318-08.PDF; RoHS: FALSE; PackageVersion: Rev. AP, 11/2009; Polarity: NPN; PartNumber: BSS64LT1; Mounting Technology: Surface Mount; PackageDescription: 3-Pin Small Outline Transistor, Body 2.92 x 1.3 mm, Pitch 0.95 mm; Packing: Tape and Reel; DatasheetVersion: Rev. 5; PackageReference: SOT-23-3-318-08
R85 = RES 2k 1/8W: RES SMD 2K OHM 5% 1/8W 0805; Power (Watts): 0.125W; Package: 0805; Value: 2k; Tolerance: 5%
R86 R90 R94 R95 R98 = RES 270.0 1/8W: RES SMD 270 OHM 5% 1/8W 0805; Power (Watts): 0.125W; Package: 0805; Value: 270; Tolerance: 5%
R87 = RES 182.0 1/8W: RES SMD 182 OHM 1% 1/8W 0805; Power (Watts): 0.125W; Package: 0805; Value: 182; Tolerance: 1%
R88 = RES 4.7k 1/8W - 5%: RES SMD 4.7k OHM 5% 1/8W 0805; Power (Watts): 0.125W; Package: 0805; Value: 4.7k; Tolerance: 5%
R89 R99 = RES 47k 1/8W - 1%: RES SMD 47K OHM 1% 1/8W 0805; Power (Watts): 0.125W; Package: 0805; Value: 47k; Tolerance: 1%
R91 = RES 47.0 1/8W - 1%: RES SMD 47 OHM 1% 1/8W 0805; Power (Watts): 0.125W; Package: 0805; Value: 47; Tolerance: 1%
R92 R93 R100 = RES 100k 1/8W - 1%: RES SMD 100K OHM 1% 1/8W 0805; Power (Watts): 0.125W; Package: 0805; Value: 100k; Tolerance: 1%
R96 = RES 1k 1/8W: RES SMD 1K OHM 5% 1/8W 0805; Power (Watts): 0.125W; Package: 0805; Value: 1k; Tolerance: 5%
R97 = RES 330.0 1/8W - 1%: RES SMD 330 OHM 1% 1/8W 0805; Rating: 0.125W; Package: 0805; Value: 330; Tolerance: 1%
R115-R122 = RES 10k 1/8W - 1%: RES SMD 10K OHM 1% 1/8W 0805; Power (Watts): 0.125W; Package: 0805; Value: 10k; Tolerance: 1%
S2 S4 = DS02-254-1L-04BE: Dip Switch Piano Key 4-position; Package: None; Price: None; Value: *; MP: DS02-254-1L-04BE; Availability: Unavailable
S3 = BUZZER PKM13EPYH4000-A0: Buzzers Transducer, Externally Driven Piezo 1.5V 4kHz 70dB @ 1.5V, 10cm Through Hole PC Pins; MF: Murata; Arrow_Electronics-Purchase-URL: https://snapeda.com/shop?store=Arrow+Electronics&id=4970420; Value: *; SnapEDA_Link: https://www.snapeda.com/parts/PKM13EPYH4000-A0/Murata/view-part/4970420/?ref=snap; Package: Radial-2 Murata; MP: PKM13EPYH4000-A0; Digikey Part: 490-4698-1-ND

## Sheet Mainboard_Geneva_Interface.SchDoc
size A
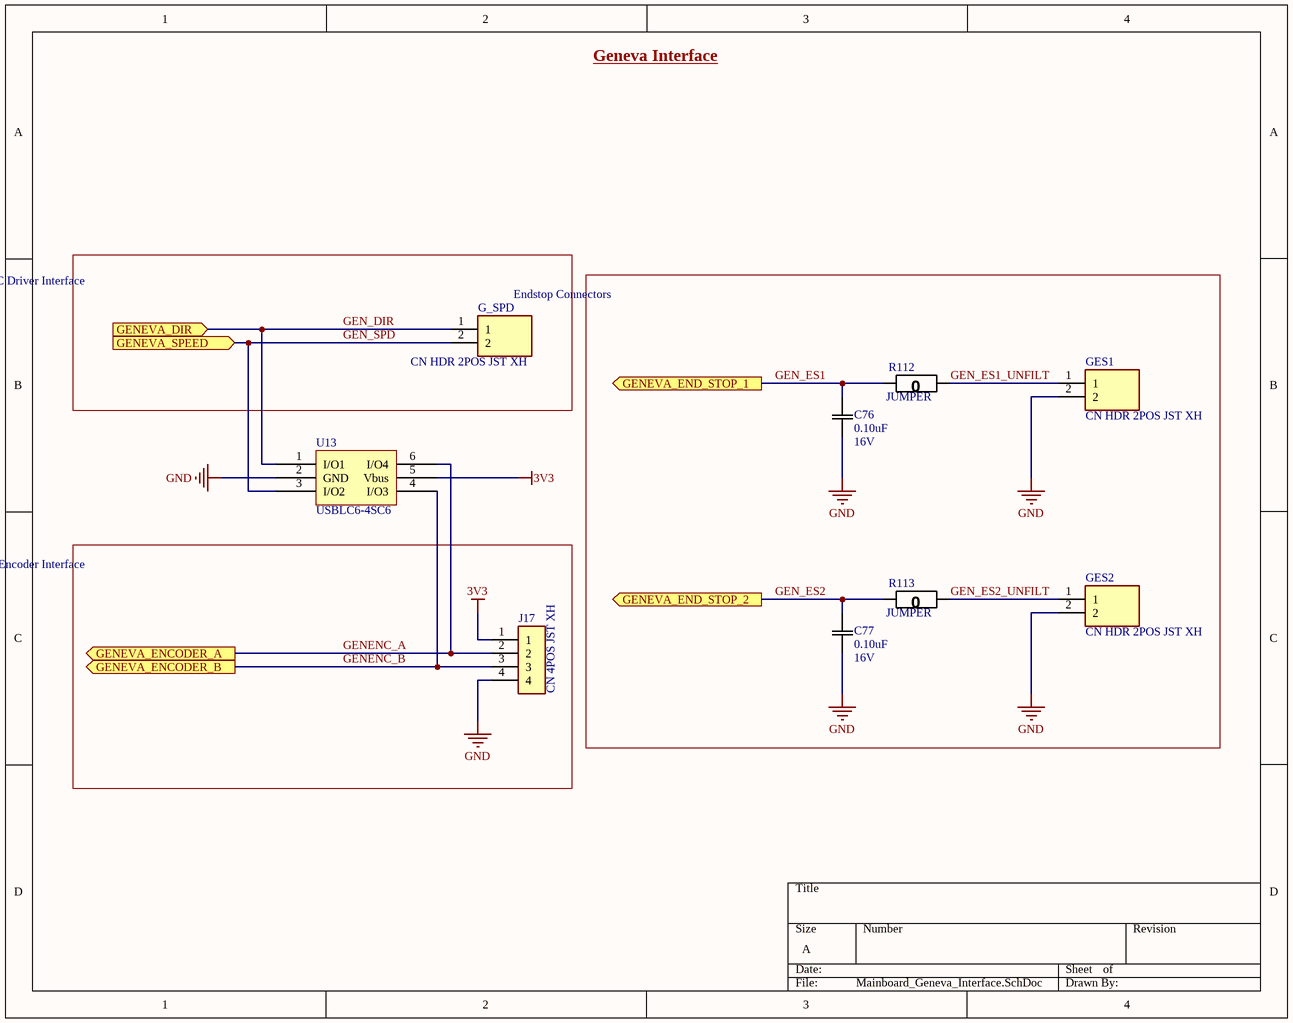
[diagram p12: Mainboard_Geneva_Interface.SchDoc]

### Parts
C76  Rating: 16V  [0603]  (hidden comment: 0.10uF)
C77  Rating: 16V  [0603]  (hidden comment: 0.10uF)
G_SPD  CN HDR 2POS JST XH  [JST_B2B-XH-A(LF)(SN)]
GES1  CN HDR 2POS JST XH  [JST_B2B-XH-A(LF)(SN)]
GES2  CN HDR 2POS JST XH  [JST_B2B-XH-A(LF)(SN)]
J17  CN 4POS JST XH  [JST_B4B-XH-A(LF)(SN)]
R112  JUMPER  [0603]
R113  JUMPER  [0603]
U13  USBLC6-4SC6  [SOT23-6L]

### Blocks framed on the sheet
DC Driver Interface: G_SPD
Endstop Connectors: C76 C77 GES1 GES2 R112 R113
Encoder Interface: J17

### Ports
GENEVA_DIR (in), GENEVA_ENCODER_A (out), GENEVA_ENCODER_B (out), GENEVA_END_STOP_1 (out), GENEVA_END_STOP_2 (out), GENEVA_SPEED (in)

### Nets
3V3: J17.1 U13.5(Vbus)
GND: C76.2(C2) C77.2(C2) GES1.2 GES2.2 J17.4 U13.2(GND)
GEN_DIR: G_SPD.1 U13.1(I/O1) ; port GENEVA_DIR
GEN_ES1: C76.1(C1) R112.2(R2) ; port GENEVA_END_STOP_1
GEN_ES1_UNFILT: GES1.1 R112.1(R1)
GEN_ES2: C77.1(C1) R113.2(R2) ; port GENEVA_END_STOP_2
GEN_ES2_UNFILT: GES2.1 R113.1(R1)
GEN_SPD: G_SPD.2 U13.3(I/O2) ; port GENEVA_SPEED
GENENC_A: J17.2 U13.6(I/O4) ; port GENEVA_ENCODER_A
GENENC_B: J17.3 U13.4(I/O3) ; port GENEVA_ENCODER_B

### Notes on the sheet
- Geneva Interface

### Library data of the parts
C76 C77 = CAP 0.10uF 16V: CAP CER 0.10UF 16V X5R 0603/0805; Tolerance: 10%; Package: 0603/0805; Temperature Coefficient: X5R; Operating Temperature: -55°C ~ 85°C; Value: 0.10uF
G_SPD GES1 GES2 = CN HDR 2POS JST XH: Connector Header Through Hole 2 position 0.098 _2.50mm_ / JST XH; MP: B2B-XH-A_LF__SN_; MF: JST Sales; Price: None; Package: None; Value: *; Availability: Unavailable; SnapEDA_Link: https://www.snapeda.com/parts/B2B-XH-A%28LF%29%28SN%29/JST%20Sales%20America%20Inc./view-part/492310/?ref=snap
J17 = CN 4POS JST XH: Connector Header Through Hole 4 position 0.098 _2.50mm_ / B4B-XH-A(LF)(SN); MP: B4B-XH-A_LF__SN_; MF: JST Sales; Price: None; Package: None; Value: *; Availability: Unavailable; SnapEDA_Link: https://www.snapeda.com/parts/B4B-XH-A%28LF%29%28SN%29/JST%20Sales%20America%20Inc./view-part/447494/?ref=snap
R112 R113 = RES 0 JUMPER: RES SMD 0 OHM JUMPER GENERIC 0805; Value: 0; Package: 0805

## Sheet Mainboard_Motordriver_Interface.SchDoc
size A4
Used 5 times, as channels ME, MD, MC, MB, MA. Parts and nets are listed once, with the designators drawn on the sheet.
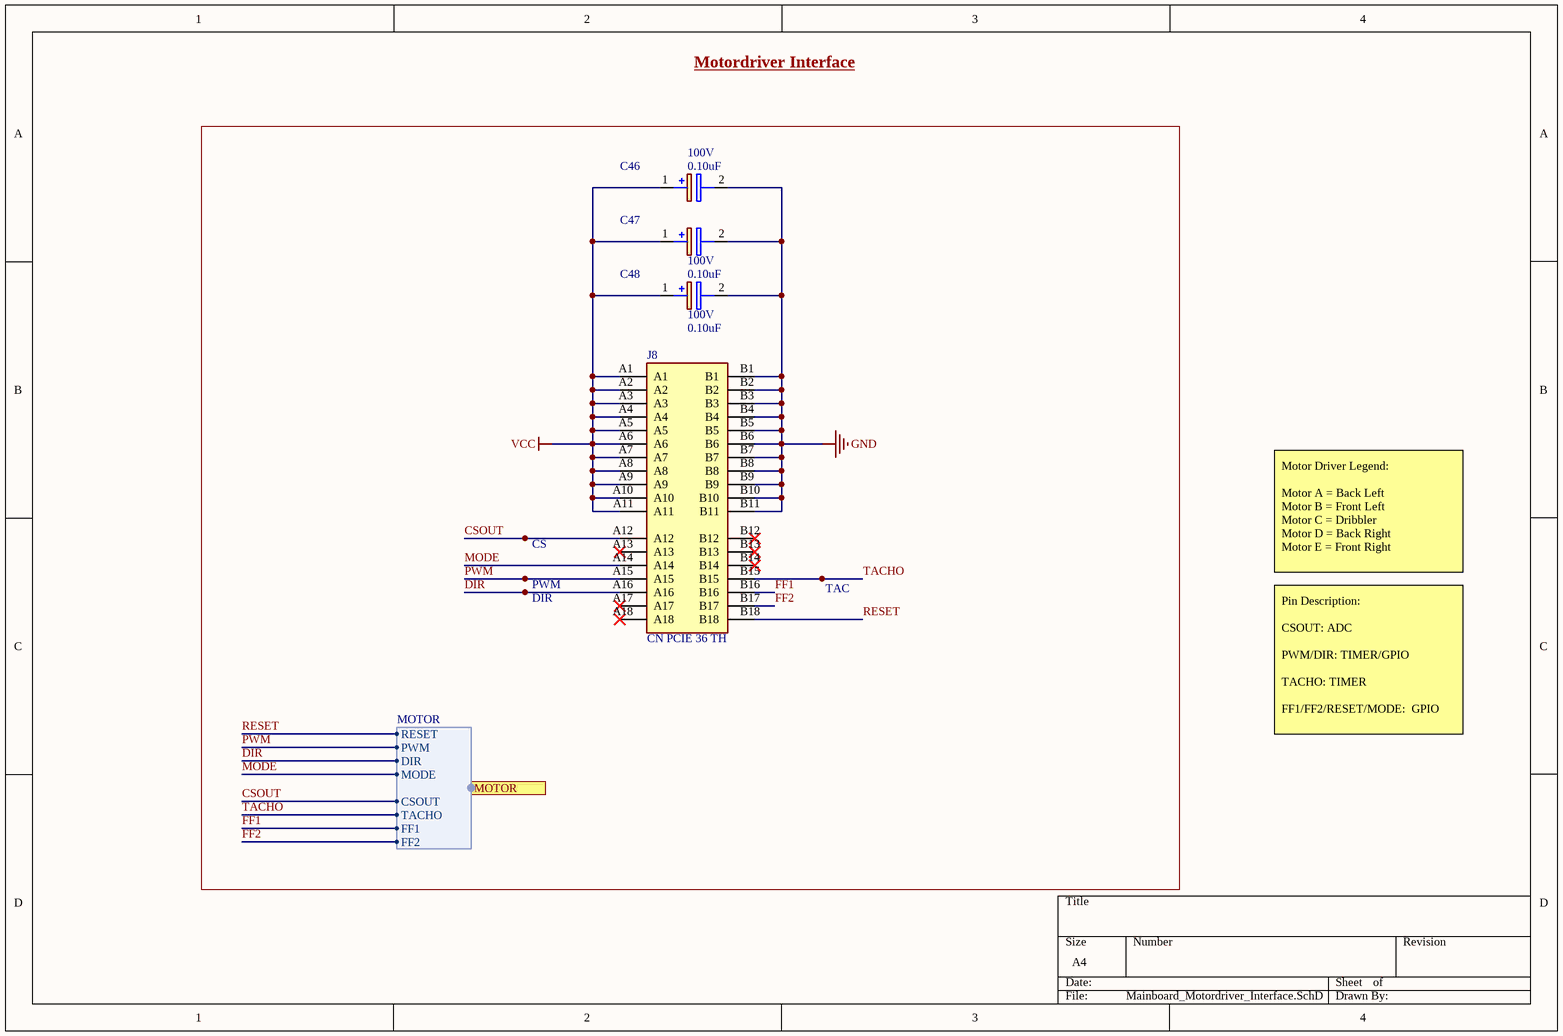
[diagram p13: Mainboard_Motordriver_Interface.SchDoc]

### Parts
C46  value 0.10uF  Rating: 100V  [CAPPRD200W50D525H1250]  (hidden comment: CAP POL 0.1uF 100V)
C47  value 0.10uF  Rating: 100V  [CAPPRD200W50D525H1250]  (hidden comment: CAP POL 0.1uF 100V)
C48  value 0.10uF  Rating: 100V  [CAPPRD200W50D525H1250]  (hidden comment: CAP POL 0.1uF 100V)
CS  Test Point (Via)  [TP]  (value not drawn)
DIR  Test Point (Via)  [TP]  (value not drawn)
J8  CN PCIE 36 TH  [CN PCIE 36 TH]
PWM  Test Point (Via)  [TP]  (value not drawn)
TAC  Test Point (Via)  [TP]  (value not drawn)

### Ports
MOTOR (harness MOTOR)

### Harnesses
MOTOR: DIR, MODE, TACHO, FF1, FF2, PWM, RESET, CSOUT

### Nets
GND: C46.2(-) C47.2(-) C48.2(-) J8.B1 J8.B2 J8.B3 J8.B4 J8.B5 J8.B6 J8.B7 J8.B8 J8.B9 J8.B10 J8.B11
VCC: C46.1(+) C47.1(+) C48.1(+) J8.A1 J8.A2 J8.A3 J8.A4 J8.A5 J8.A6 J8.A7 J8.A8 J8.A9 J8.A10 J8.A11
CSOUT: CS.1 J8.A12 ; port MOTOR.CSOUT
DIR: DIR.1 J8.A16 ; port MOTOR.DIR
FF1: J8.B16 ; port MOTOR.FF1
FF2: J8.B17 ; port MOTOR.FF2
MODE: J8.A14 ; port MOTOR.MODE
PWM: J8.A15 PWM.1 ; port MOTOR.PWM
RESET: J8.B18 ; port MOTOR.RESET
TACHO: J8.B15 TAC.1 ; port MOTOR.TACHO

Not connected (* = marked no-connect by the designer): J8 A13* A17* A18* B12* B13* B14*

### Channels
ME: designators end in _ME
MD: designators end in _MD
MC: designators end in _MC
MB: designators end in _MB
MA: designators end in _MA

### Notes on the sheet
- Motordriver Interface
- Motor Driver Legend:
  Motor A = Back Left
  Motor B = Front Left
  Motor C = Dribbler
  Motor D = Back Right
  Motor E = Front Right
- Pin Description:
  CSOUT: ADC
  PWM/DIR: TIMER/GPIO
  TACHO: TIMER
  FF1/FF2/RESET/MODE:  GPIO

### Library data of the parts
C46-C48 = CAP POL 0.1uF 100V: 0.1µF 100V Aluminum Electrolytic Capacitors, Through-Hole, Radial, Can 2000 Hrs @ 85°C; Manufacturer_Name: Nichicon; Manufacturer_Part_Number: UKL2A0R1KDD; Datasheet Link: http://www.mouser.com/ds/2/293/e-ukl-876305.pdf; Height: 12.5mm; Mouser Part Number: 647-UKL2A0R1KDD; Mouser Price/Stock: https://www.mouser.com/Search/Refine.aspx?Keyword=647-UKL2A0R1KDD; Supplier 1: Digi-Key; Supplier Part Number 1: 493-16876-ND
J8 = CN PCIE 36 TH: 36 Position Female Connector PCI Expressâ„¢ Gold 0.039 _1.00mm_ Black 10018784-10210TLF; MF: Amphenol ICC; Price: None; SnapEDA_Link: https://www.snapeda.com/parts/10018784-10210TLF/Amphenol%20FCI/view-part/520950/?ref=snap; Availability: Unavailable; MP: 10018784-10210TLF; Package: None; Value: *

## Nets that join several sheets
3V3: Mainboard_Encoder_Interface (18 pins), Mainboard_Power_Interface (5 pins), Mainboard_RMII_Interface (10 pins), Mainboard_Wifi_Interface (J9.1), Mainboard_Breakbeam_Interface (J10.1 J11.1), MainBoard_MCU_Power (C2.1 U1.2), Mainboard_MCU_Breakout (34 pins), Mainboard_MCU_Func (C50.2 C51.2 U9.5 U9.8), Mainboard_ThermistorAmp (C75.1 U12.8), Mainboard_User_Interface (6 pins), Mainboard_Geneva_Interface (J17.1 U13.5)
5V_PWR_BRD: Mainboard_Power_Interface (J6.4 J6.8), MainBoard_MCU_Power (D2.A)
GND: Mainboard_Encoder_Interface (34 pins), Mainboard_Power_Interface (5 pins), Mainboard_RMII_Interface (23 pins), Mainboard_Wifi_Interface (J9.5), Mainboard_Breakbeam_Interface (J10.3 J11.2), MainBoard_MCU_Power (C1.2 C2.2 U1.1), Mainboard_Debug_Interface (6 pins), Mainboard_MCU_Breakout (38 pins), Mainboard_MCU_Func (8 pins), Mainboard_ThermistorAmp (C75.2 J13.2 U12.4), Mainboard_User_Interface (20 pins), Mainboard_Geneva_Interface (6 pins), ME (14 pins), MD (14 pins), MC (14 pins), MB (14 pins), MA (14 pins)
VCC: Mainboard_Power_Interface (J6.1 J6.2 J6.5), Mainboard_User_Interface (R88.2), ME (14 pins), MD (14 pins), MC (14 pins), MB (14 pins), MA (14 pins)
BREAKBEAM: Mainboard_Breakbeam_Interface (J10.2), Mainboard_MCU_Breakout (U11.93)
CHARGE_PWR_BRD: Mainboard_Power_Interface (J7.10), Mainboard_MCU_Breakout (PWR_CHRG.1 U11.129)
CHIP_PWR_BRD: Mainboard_Power_Interface (J7.11), Mainboard_MCU_Breakout (CHIP.1 U11.140)
CSOUT: Mainboard_MCU_Breakout (U11.37), ME (CS_ME.1 J8_ME.A12)
CSOUT: Mainboard_MCU_Breakout (U11.46), MD (CS_MD.1 J8_MD.A12)
CSOUT: Mainboard_MCU_Breakout (U11.47), MC (CS_MC.1 J8_MC.A12)
CSOUT: Mainboard_MCU_Breakout (U11.49), MB (CS_MB.1 J8_MB.A12)
CSOUT: Mainboard_MCU_Breakout (U11.50), MA (CS_MA.1 J8_MA.A12)
DIR: Mainboard_MCU_Breakout (U11.69), MB (DIR_MB.1 J8_MB.A16)
DIR: Mainboard_MCU_Breakout (U11.26), ME (DIR_ME.1 J8_ME.A16)
DIR: Mainboard_MCU_Breakout (U11.86), MA (DIR_MA.1 J8_MA.A16)
DIR: Mainboard_MCU_Breakout (U11.55), MD (DIR_MD.1 J8_MD.A16)
DIR: Mainboard_MCU_Breakout (R1.1 R114.2), MC (DIR_MC.1 J8_MC.A16)
DONE_PWR_BRD: Mainboard_Power_Interface (J7.4), Mainboard_MCU_Breakout (PWR_DONE.1 U11.132)
DRIBBLER_MODE: Mainboard_MCU_Breakout (D_MODE.1 U11.59), MC (J8_MC.A14)
DRIBBLER_RESET: Mainboard_MCU_Breakout (D_RESET.1 U11.58), MC (J8_MC.B18)
DRIVE_RESET: Mainboard_MCU_Breakout (M_RST.1 U11.48), ME (J8_ME.B18), MD (J8_MD.B18), MB (J8_MB.B18), MA (J8_MA.B18)
EA_COS: Mainboard_Encoder_Interface (C13.1 EA_COS.1 R12.1), Mainboard_MCU_Breakout (U11.28)
EA_SIN: Mainboard_Encoder_Interface (C17.1 EA_SIN.1 R24.1), Mainboard_MCU_Breakout (U11.29)
EB_COS: Mainboard_Encoder_Interface (C26.1 EB_COS.1 R43.1), Mainboard_MCU_Breakout (U11.14)
EB_SIN: Mainboard_Encoder_Interface (C30.1 EB_SIN.1 R55.1), Mainboard_MCU_Breakout (U11.13)
EC_COS: Mainboard_Encoder_Interface (C14.1 EC_COS.1 R13.1), Mainboard_MCU_Breakout (U11.18)
EC_SIN: Mainboard_Encoder_Interface (C18.1 EC_SIN.1 R25.1), Mainboard_MCU_Breakout (U11.15)
ED_COS: Mainboard_Encoder_Interface (C25.1 ED_COS.1 R38.1), Mainboard_MCU_Breakout (U11.20)
ED_SIN: Mainboard_Encoder_Interface (C29.1 ED_SIN.1 R50.1), Mainboard_MCU_Breakout (U11.19)
FAULT_PWR_BRD: Mainboard_Power_Interface (J7.3), Mainboard_MCU_Breakout (PWR_FLT.1 U11.142)
FF1: Mainboard_MCU_Breakout (U11.79), MA (J8_MA.B16)
FF1: Mainboard_MCU_Breakout (U11.63), MB (J8_MB.B16)
FF1: Mainboard_MCU_Breakout (U11.12), ME (J8_ME.B16)
FF1: Mainboard_MCU_Breakout (U11.53), MD (J8_MD.B16)
FF1: Mainboard_MCU_Breakout (U11.56), MC (J8_MC.B16)
FF2: Mainboard_MCU_Breakout (U11.80), MA (J8_MA.B17)
FF2: Mainboard_MCU_Breakout (U11.65), MB (J8_MB.B17)
FF2: Mainboard_MCU_Breakout (U11.22), ME (J8_ME.B17)
FF2: Mainboard_MCU_Breakout (U11.54), MD (J8_MD.B17)
FF2: Mainboard_MCU_Breakout (U11.57), MC (J8_MC.B17)
GEN_DIR: Mainboard_MCU_Breakout (U11.126), Mainboard_Geneva_Interface (G_SPD.1 U13.1)
GEN_ES1: Mainboard_MCU_Breakout (U11.91), Mainboard_Geneva_Interface (C76.1 R112.2)
GEN_ES2: Mainboard_MCU_Breakout (U11.119), Mainboard_Geneva_Interface (C77.1 R113.2)
GEN_SPD: Mainboard_MCU_Breakout (U11.101), Mainboard_Geneva_Interface (G_SPD.2 U13.3)
GENENC_A: Mainboard_MCU_Breakout (U11.97), Mainboard_Geneva_Interface (J17.2 U13.6)
GENENC_B: Mainboard_MCU_Breakout (U11.96), Mainboard_Geneva_Interface (J17.3 U13.4)
KICK_PWR_BRD: Mainboard_Power_Interface (J7.12), Mainboard_MCU_Breakout (KICK.1 U11.139)
MODE: Mainboard_MCU_Breakout (M_MODE.1 U11.68), ME (J8_ME.A14), MD (J8_MD.A14), MB (J8_MB.A14), MA (J8_MA.A14)
MOTOR_A_PWM: Mainboard_MCU_Breakout (U11.67), MA (J8_MA.A15 PWM_MA.1)
MOTOR_A_TACHO: Mainboard_MCU_Breakout (U11.85), MA (J8_MA.B15 TAC_MA.1)
MOTOR_B_PWM: Mainboard_MCU_Breakout (U11.66), MB (J8_MB.A15 PWM_MB.1)
MOTOR_B_TACHO: Mainboard_MCU_Breakout (U11.82), MB (J8_MB.B15 TAC_MB.1)
MOTOR_C_PWM: Mainboard_MCU_Breakout (U11.64), MC (J8_MC.A15 PWM_MC.1)
MOTOR_C_TACHO: Mainboard_MCU_Breakout (U11.81), MC (J8_MC.B15 TAC_MC.1)
MOTOR_D_PWM: Mainboard_MCU_Breakout (U11.60), MD (J8_MD.A15 PWM_MD.1)
MOTOR_D_TACHO: Mainboard_MCU_Breakout (U11.76), MD (J8_MD.B15 TAC_MD.1)
MOTOR_E_PWM: Mainboard_MCU_Breakout (U11.34), ME (J8_ME.A15 PWM_ME.1)
MOTOR_E_TACHO: Mainboard_MCU_Breakout (U11.75), ME (J8_ME.B15 TAC_ME.1)
NetD3_1: Mainboard_MCU_Breakout (U11.100), Mainboard_User_Interface (D3.1 R85.2)
NetF1_1: MainBoard_MCU_Power (F1.1), Mainboard_Debug_Interface (U10.22)
NetHV_FB1_1: Mainboard_Power_Interface (HV_FB1.1), Mainboard_MCU_Breakout (U11.21), Mainboard_User_Interface (R89.2)
NetJ9_2: Mainboard_Wifi_Interface (J9.2), Mainboard_MCU_Breakout (U11.114)
NetJ9_3: Mainboard_Wifi_Interface (J9.3), Mainboard_MCU_Breakout (U11.115)
NetJ9_4: Mainboard_Wifi_Interface (J9.4), Mainboard_MCU_Breakout (U11.122 WIFI_RST.1)
NetJ12_1: Mainboard_MCU_Breakout (U11.111), Mainboard_User_Interface (J12.1)
NetJ12_2: Mainboard_MCU_Breakout (U11.112), Mainboard_User_Interface (J12.2)
NetJ12_3: Mainboard_MCU_Breakout (U11.116), Mainboard_User_Interface (J12.3)
NetJ12_5: Mainboard_MCU_Breakout (U11.113), Mainboard_User_Interface (J12.5)
NetJ12_7: Mainboard_MCU_Breakout (U11.98), Mainboard_User_Interface (J12.7)
NetJ12_8: Mainboard_MCU_Breakout (U11.99), Mainboard_User_Interface (J12.8)
NetPboot1_1: MainBoard_Top (Pboot1.1 Pboot1.2), Mainboard_MCU_Breakout (R101.1 U11.138)
NetR91_2: Mainboard_MCU_Breakout (U11.118), Mainboard_User_Interface (R91.2)
NetR94_1: Mainboard_MCU_Breakout (U11.90), Mainboard_User_Interface (R94.1)
NetR95_1: Mainboard_MCU_Breakout (U11.89), Mainboard_User_Interface (R95.1)
NetR97_1: Mainboard_MCU_Breakout (U11.88), Mainboard_User_Interface (R97.1)
NetR99_2: Mainboard_MCU_Breakout (U11.117), Mainboard_User_Interface (R99.2)
NetR109_1: Mainboard_MCU_Breakout (U11.41), Mainboard_ThermistorAmp (R109.1)
NetR110_1: Mainboard_MCU_Breakout (U11.42), Mainboard_ThermistorAmp (R110.1)
NetR111_1: Mainboard_MCU_Breakout (U11.40), Mainboard_ThermistorAmp (R111.1)
NetR115_2: Mainboard_MCU_Breakout (U11.124), Mainboard_User_Interface (R115.2)
NetR116_2: Mainboard_MCU_Breakout (U11.125), Mainboard_User_Interface (R116.2)
NetR117_2: Mainboard_MCU_Breakout (U11.127), Mainboard_User_Interface (R117.2)
NetR118_2: Mainboard_MCU_Breakout (U11.128), Mainboard_User_Interface (R118.2)
NetR119_2: Mainboard_MCU_Breakout (U11.141), Mainboard_User_Interface (R119.2)
NetR120_2: Mainboard_MCU_Breakout (U11.1), Mainboard_User_Interface (R120.2)
NetR121_2: Mainboard_MCU_Breakout (U11.2), Mainboard_User_Interface (R121.2)
NetR122_2: Mainboard_MCU_Breakout (U11.3), Mainboard_User_Interface (R122.2)
NetU9_4: Mainboard_MCU_Breakout (U11.5), Mainboard_MCU_Func (U9.4)
NetU9_9: Mainboard_MCU_Breakout (U11.7), Mainboard_MCU_Func (U9.9)
NetU9_13: Mainboard_MCU_Breakout (U11.11), Mainboard_MCU_Func (U9.13)
NetU9_14: Mainboard_MCU_Breakout (U11.10), Mainboard_MCU_Func (U9.14)
NetU10_4: Mainboard_Debug_Interface (U10.4), Mainboard_MCU_Breakout (U11.105)
NetU10_6: Mainboard_Debug_Interface (U10.6), Mainboard_MCU_Breakout (U11.133)
NetU10_12: Mainboard_Debug_Interface (U10.12), Mainboard_MCU_Breakout (U11.77)
NetU10_13: Mainboard_Debug_Interface (U10.13), Mainboard_MCU_Breakout (U11.109)
NetU10_15: Mainboard_Debug_Interface (U10.15), Mainboard_MCU_Breakout (U11.78)
NRST: Mainboard_RMII_Interface (U8.15), Mainboard_Debug_Interface (U10.31), Mainboard_MCU_Breakout (U11.25), Mainboard_MCU_Func (C49.2 S1.4)
PMS_ALERT_PWR_BRD: Mainboard_Power_Interface (J7.5 R84.1), Mainboard_MCU_Breakout (U11.135)
PMS_SCL_PWR_BRD: Mainboard_Power_Interface (J7.2 R83.1), Mainboard_MCU_Breakout (U11.136)
PMS_SDA_PWR_BRD: Mainboard_Power_Interface (J7.1 R82.1), Mainboard_MCU_Breakout (U11.137)
RMII_CRS_DV: Mainboard_RMII_Interface (R74.2), Mainboard_MCU_Breakout (U11.43)
RMII_MDC: Mainboard_RMII_Interface (U8.13), Mainboard_MCU_Breakout (U11.27)
RMII_MDIO: Mainboard_RMII_Interface (R63.1 U8.12), Mainboard_MCU_Breakout (U11.36)
RMII_REF_CLK: Mainboard_RMII_Interface (R76.2), Mainboard_MCU_Breakout (U11.35)
RMII_RXD0: Mainboard_RMII_Interface (R71.2), Mainboard_MCU_Breakout (U11.44)
RMII_RXD1: Mainboard_RMII_Interface (R72.2), Mainboard_MCU_Breakout (U11.45)
RMII_TX_EN: Mainboard_RMII_Interface (U8.16), Mainboard_MCU_Breakout (U11.70)
RMII_TXD0: Mainboard_RMII_Interface (U8.17), Mainboard_MCU_Breakout (U11.73)
RMII_TXD1: Mainboard_RMII_Interface (U8.18), Mainboard_MCU_Breakout (U11.74)